# EAGLE design USB-Adapter (EAGLE 6.3)
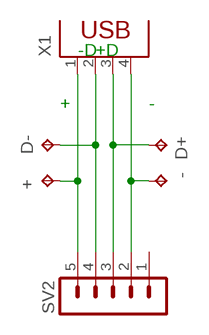
[diagram p0: schematic, sheet 1]

## Parts
+  TPPAD1-13  [P1-13]
-  TPPAD1-13  [P1-13]
D+  TPPAD1-13  [P1-13]
D-  TPPAD1-13  [P1-13]
SV2  MA05-1  [MA05-1]
X1  PN87520  [PN87520]

## Nets
+: +.TP SV2.5 X1.1
D+: D+.TP SV2.3 X1.3
D-: D-.TP SV2.4 X1.2
GND: -.TP SV2.2 X1.4
Unconnected: SV2.1

## Notes on the sheet
- -D | +D
- + | -

## Library data of the parts
+ - D+ D- = testpad:TP: Test pad
SV2 = con-lstb:MA05-1: PIN HEADER; OC_FARNELL: unknown; OC_NEWARK: unknown
X1 = con-berg:PN87520: BERG USB connector; OC_FARNELL: unknown; OC_NEWARK: unknown

## Board
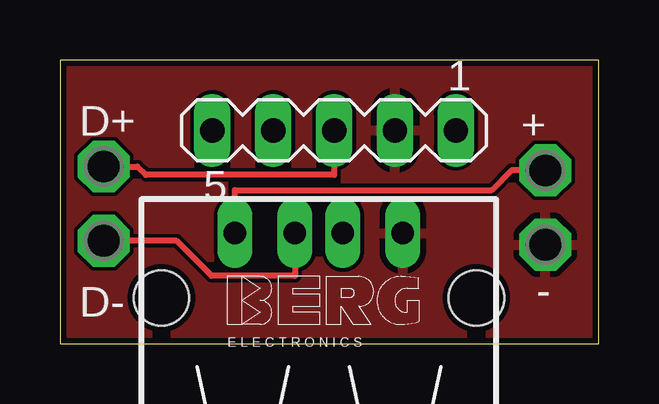
[diagram p1: board, top side]
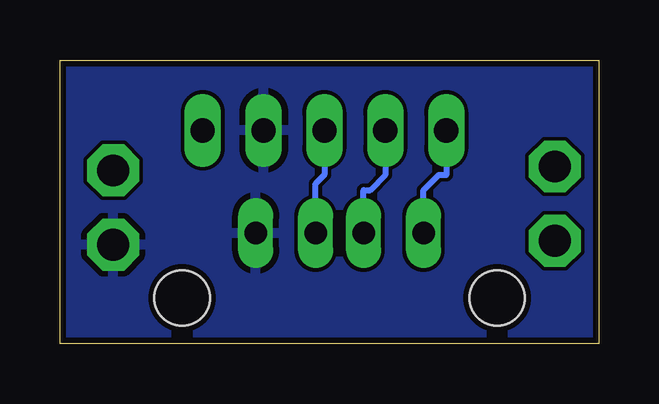
[diagram p2: board, bottom side, seen from below]

Size 22.46 x 11.82 mm. Coordinates in mm from the lower left corner, seen from the top.
Outline: 0,0 22.46,0 22.46,11.82 0,11.82 0,0
Copper layers (1*16): Top 0.035mm / dielectric 1.5mm / Bottom 0.035mm
Design rules "Fusion_eagle_rule_v1.1": minimum track width 6mil, minimum drill 12mil, track to track 6mil, track to pad 6mil, pad to pad 6mil, via to via 6mil, smd to smd 0mil, copper to edge 10mil, drill to drill 10mil, minimum pad ring 10mil, minimum via ring 6mil, stop-mask expansion 2mil, vias tented up to drill 100mil, thermal gap 10mil

### Footprints (pad centres in the part's own frame; a part is rotated, then mirrored left to right if it is on the bottom)
P1-13 = drill 1.321 pad 2.159 octagon: TP 0,0
MA05-1 = drill 1.016 long: 1 -5.08,0; 2 -2.54,0; 3 0,0; 4 2.54,0; 5 5.08,0
PN87520 = drill 0.95 long: 1 -3.5,2.71; 2 -1,2.71; 3 1,2.71; 4 3.5,2.71 | hole 2.3: -6.57,0; 6.57,0

### Placement (x,y rotation side)
+  20.24,7.22 0 top
-  20.24,4.13 0 top
D+  1.82,7.38 0 top
D-  1.82,4.29 0 top
SV2  11.43,8.89 180 top
X1  10.79,1.91 0 top

### Tracks (layer width: path | path; a pad name or v marks a point on that pad's centre or on a via)
+
  Top 0.254: +.TP 18.83,7.22 18.01,6.4 7.29,6.4 X1.1
  Bottom 0.254: SV2.5 6.35,7.04 6.66,7.04 7.29,6.4 X1.1
D+
  Top 0.254: D+.TP 3.23,7.38 3.58,7.04 11.43,7.04 SV2.3
  Bottom 0.254: SV2.3 11.43,7.04 11.79,6.67 X1.3
D-
  Top 0.254: X1.2 9.79,2.83 6.32,2.83 4.86,4.29 D-.TP
  Bottom 0.254: X1.2 9.79,6.4 9.52,6.4 8.89,7.04 SV2.4
GND
  pour Bottom: -5,-5 -5,15 25,15 25,-5
  pour Top: 0,-5 0,15 30,15 30,-5